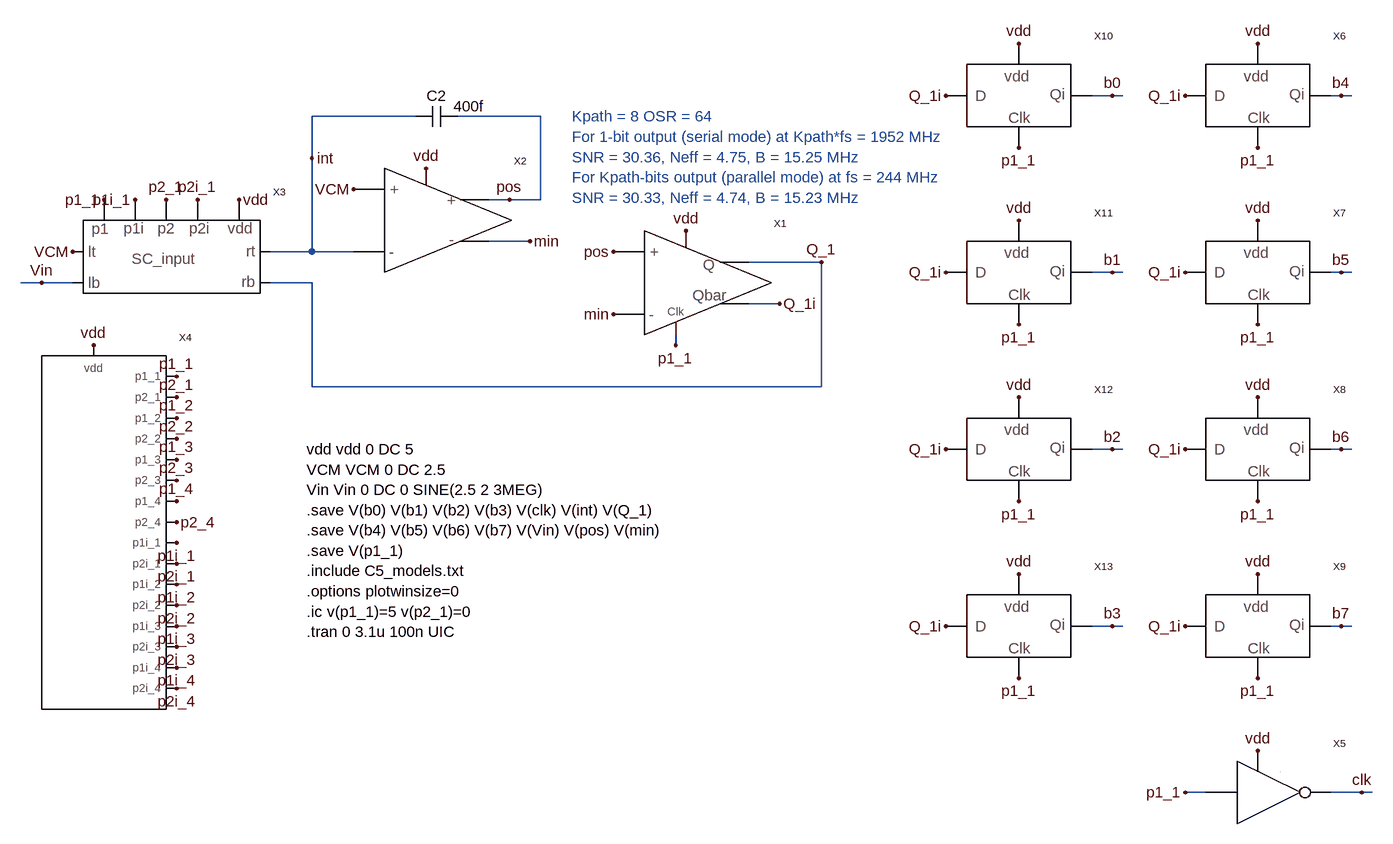
[diagram p0: schematic _Fig9_33_1bit_Matlab_MSD.asc]
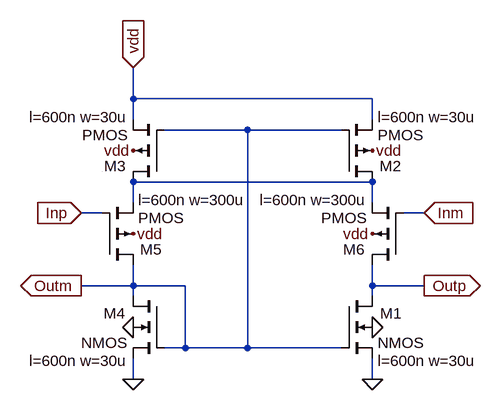
[diagram p1: sub-circuit amp.asc]
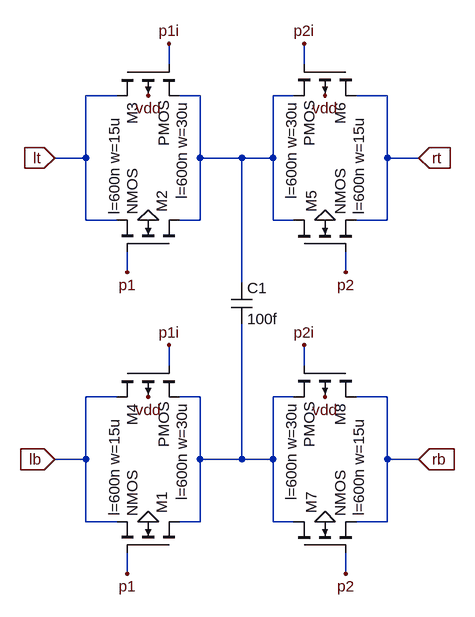
[diagram p2: sub-circuit sc_input.asc]
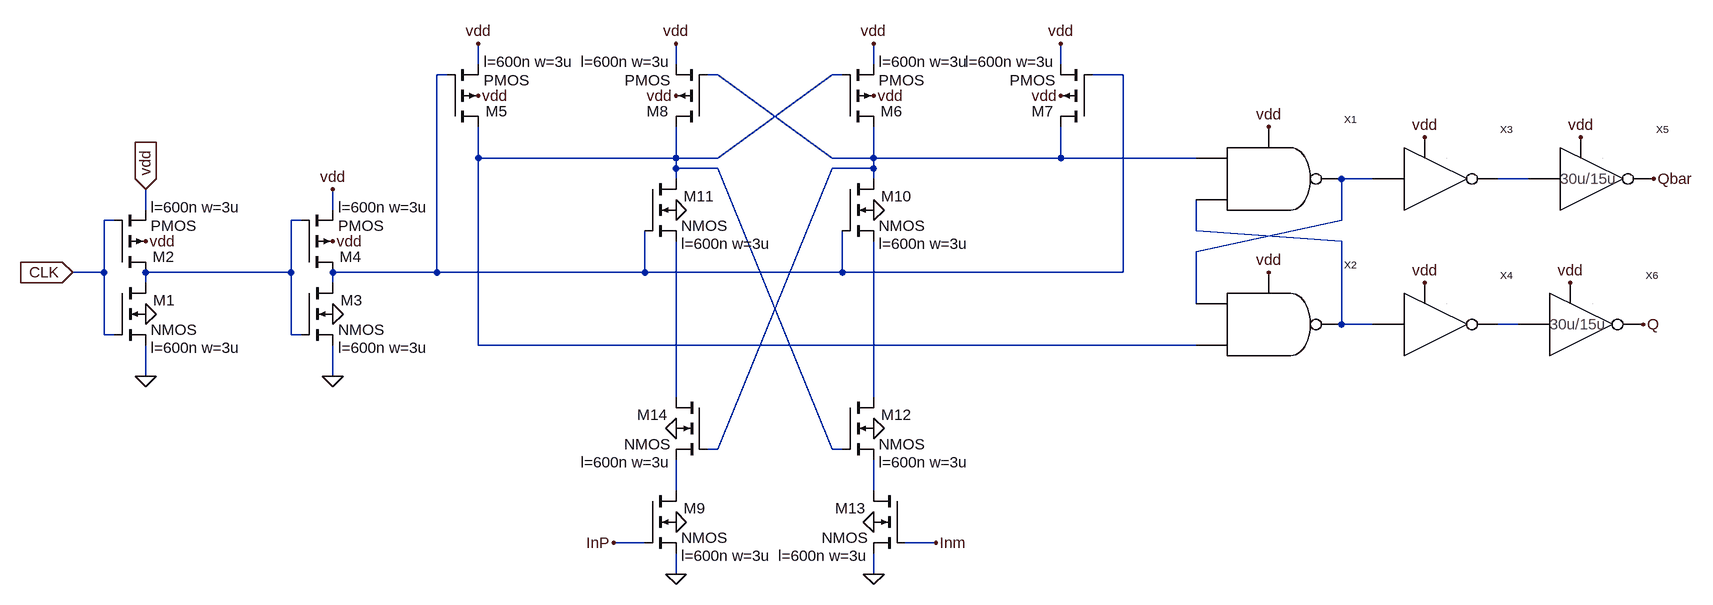
[diagram p3: sub-circuit clk_comparator.asc]
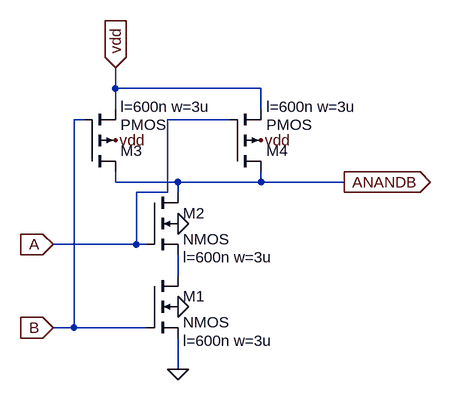
[diagram p4: sub-circuit nand_2.asc]
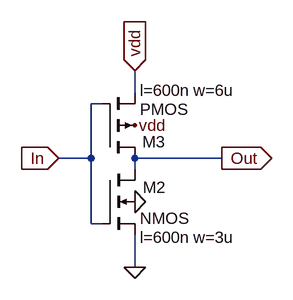
[diagram p5: sub-circuit inv_6u_3u.asc]
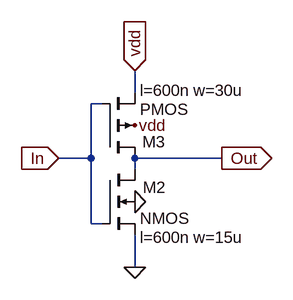
[diagram p6: sub-circuit inv_30u_15u.asc]
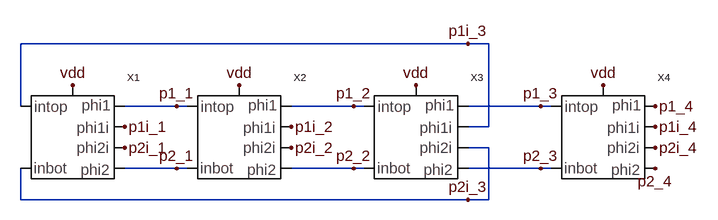
[diagram p7: sub-circuit clock_gen.asc]
_Fig9_33_1bit_Matlab_MSD.asc, the LTspice schematic file:
Version 4
SHEET 1 4120 2204
WIRE 2112 800 2080 800
WIRE 2128 800 2112 800
WIRE 2464 800 2448 800
WIRE 2480 800 2464 800
WIRE 1040 832 880 832
WIRE 1232 832 1104 832
WIRE 880 896 880 832
WIRE 1184 960 1152 960
WIRE 1232 960 1232 832
WIRE 1232 960 1184 960
WIRE 1216 1024 1152 1024
WIRE 880 1040 880 896
WIRE 880 1040 816 1040
WIRE 944 1040 880 1040
WIRE 1664 1056 1552 1056
WIRE 2112 1072 2080 1072
WIRE 2128 1072 2112 1072
WIRE 2464 1072 2448 1072
WIRE 2480 1072 2464 1072
WIRE 464 1088 432 1088
WIRE 512 1088 464 1088
WIRE 880 1088 816 1088
WIRE 1600 1120 1552 1120
WIRE 1440 1184 1440 1168
WIRE 880 1248 880 1088
WIRE 1664 1248 1664 1056
WIRE 1664 1248 880 1248
WIRE 2112 1344 2080 1344
WIRE 2128 1344 2112 1344
WIRE 2464 1344 2448 1344
WIRE 2480 1344 2464 1344
WIRE 2112 1616 2080 1616
WIRE 2128 1616 2112 1616
WIRE 2464 1616 2448 1616
WIRE 2480 1616 2464 1616
WIRE 2256 1872 2224 1872
WIRE 2496 1872 2448 1872
WIRE 2512 1872 2496 1872
FLAG 464 1088 Vin
FLAG 768 960 vdd
FLAG 560 960 p1_1
FLAG 656 960 p2_1
FLAG 512 1040 VCM
FLAG 1456 1008 vdd
FLAG 1440 1184 p1_1
FLAG 1664 1056 Q_1
FLAG 1344 1136 min
FLAG 1344 1040 pos
FLAG 944 944 VCM
FLAG 1184 960 pos
FLAG 880 896 int
FLAG 2224 1872 p1_1
FLAG 2112 800 b0
FLAG 2112 1072 b1
FLAG 2112 1344 b2
FLAG 2112 1616 b3
FLAG 2464 800 b4
FLAG 2464 1072 b5
FLAG 2464 1344 b6
FLAG 2464 1616 b7
FLAG 2336 1808 vdd
FLAG 2496 1872 clk
FLAG 1056 912 vdd
FLAG 1216 1024 min
FLAG 608 960 p1i_1
FLAG 704 960 p2i_1
FLAG 1600 1120 Q_1i
FLAG 544 1184 vdd
FLAG 672 1232 p1_1
FLAG 672 1264 p2_1
FLAG 672 1296 p1_2
FLAG 672 1328 p2_2
FLAG 672 1360 p1_3
FLAG 672 1392 p2_3
FLAG 672 1424 p1_4
FLAG 672 1456 p2_4
FLAG 672 1488 p1i_1
FLAG 672 1520 p2i_1
FLAG 672 1552 p1i_2
FLAG 672 1584 p2i_2
FLAG 672 1616 p1i_3
FLAG 672 1648 p2i_3
FLAG 672 1680 p1i_4
FLAG 672 1712 p2i_4
FLAG 2336 720 vdd
FLAG 2224 800 Q_1i
FLAG 2336 880 p1_1
FLAG 2336 992 vdd
FLAG 2224 1072 Q_1i
FLAG 2336 1152 p1_1
FLAG 2336 1264 vdd
FLAG 2224 1344 Q_1i
FLAG 2336 1424 p1_1
FLAG 2336 1536 vdd
FLAG 2224 1616 Q_1i
FLAG 2336 1696 p1_1
FLAG 1968 720 vdd
FLAG 1856 800 Q_1i
FLAG 1968 880 p1_1
FLAG 1968 992 vdd
FLAG 1856 1072 Q_1i
FLAG 1968 1152 p1_1
FLAG 1968 1264 vdd
FLAG 1856 1344 Q_1i
FLAG 1968 1424 p1_1
FLAG 1968 1536 vdd
FLAG 1856 1616 Q_1i
FLAG 1968 1696 p1_1
SYMBOL cap 1040 848 R270
WINDOW 0 32 32 VTop 2
WINDOW 3 47 82 VBottom 2
SYMATTR InstName C2
SYMATTR Value 400f
SYMBOL amp 992 992 R0
SYMATTR InstName X2
SYMBOL SC_input 576 1120 R0
SYMATTR InstName X3
SYMBOL clk_comparator 1392 1088 R0
SYMATTR InstName X1
SYMBOL clock_gen 592 1360 R0
SYMATTR InstName X4
SYMBOL Inv_6u_3u 2256 1872 R0
SYMATTR InstName X5
SYMBOL dflop 2256 848 R0
SYMATTR InstName X6
SYMBOL dflop 2256 1120 R0
SYMATTR InstName X7
SYMBOL dflop 2256 1392 R0
SYMATTR InstName X8
SYMBOL dflop 2256 1664 R0
SYMATTR InstName X9
SYMBOL dflop 1888 848 R0
SYMATTR InstName X10
SYMBOL dflop 1888 1120 R0
SYMATTR InstName X11
SYMBOL dflop 1888 1392 R0
SYMATTR InstName X12
SYMBOL dflop 1888 1664 R0
SYMATTR InstName X13
TEXT 1280 832 Left 2 ;Kpath = 8 OSR = 64\nFor 1-bit output (serial mode) at Kpath*fs = 1952 MHz\nSNR = 30.36, Neff = 4.75, B = 15.25 MHz\nFor Kpath-bits output (parallel mode) at fs = 244 MHz\nSNR = 30.33, Neff = 4.74, B = 15.23 MHz
TEXT 872 1344 Left 2 !vdd vdd 0 DC 5\nVCM VCM 0 DC 2.5\nVin Vin 0 DC 0 SINE(2.5 2 3MEG)\n.save V(b0) V(b1) V(b2) V(b3) V(clk) V(int) V(Q_1)\n.save V(b4) V(b5) V(b6) V(b7) V(Vin) V(pos) V(min)\n.save V(p1_1)\n.include C5_models.txt\n.options plotwinsize=0\n.ic v(p1_1)=5 v(p2_1)=0\n.tran 0 3.1u 100n UIC

amp.asc, the sub-circuit schematic file:
Version 4
SHEET 1 880 680
WIRE 48 -112 48 -160
WIRE 416 -112 48 -112
WIRE 48 -80 48 -112
WIRE 416 -80 416 -112
WIRE 224 -64 96 -64
WIRE 368 -64 224 -64
WIRE 416 16 48 16
WIRE 48 48 48 16
WIRE 416 48 416 16
WIRE 0 64 -32 64
WIRE 496 64 464 64
WIRE 48 176 48 144
WIRE 48 176 -32 176
WIRE 128 176 48 176
WIRE 416 176 416 144
WIRE 496 176 416 176
WIRE 48 192 48 176
WIRE 416 192 416 176
WIRE 128 272 128 176
WIRE 128 272 96 272
WIRE 224 272 224 -64
WIRE 224 272 128 272
WIRE 368 272 224 272
WIRE 48 320 48 288
WIRE 416 320 416 288
WIRE 0 0 0 0
FLAG 416 320 0
FLAG 416 240 0
FLAG -32 64 Inp
IOPIN -32 64 In
FLAG 416 -32 vdd
FLAG 496 176 Outp
IOPIN 496 176 Out
FLAG 48 -160 vdd
IOPIN 48 -160 In
FLAG 48 -32 vdd
FLAG 48 320 0
FLAG 48 240 0
FLAG 48 96 vdd
FLAG 416 96 vdd
FLAG 496 64 Inm
IOPIN 496 64 In
FLAG -32 176 Outm
IOPIN -32 176 Out
SYMBOL nmos4 368 192 R0
WINDOW 123 56 100 Left 2
WINDOW 0 60 27 Left 2
SYMATTR Value2 l=600n w=30u
SYMATTR InstName M1
SYMBOL pmos4 368 16 M180
WINDOW 123 56 100 Left 2
WINDOW 0 59 24 Left 2
SYMATTR Value2 l=600n w=30u
SYMATTR InstName M2
SYMBOL pmos4 96 16 R180
WINDOW 123 56 100 Left 2
WINDOW 0 59 24 Left 2
SYMATTR Value2 l=600n w=30u
SYMATTR InstName M3
SYMBOL nmos4 96 192 M0
WINDOW 123 56 100 Left 2
WINDOW 0 60 27 Left 2
SYMATTR Value2 l=600n w=30u
SYMATTR InstName M4
SYMBOL pmos4 0 144 M180
WINDOW 123 56 100 Left 2
WINDOW 0 59 24 Left 2
SYMATTR Value2 l=600n w=300u
SYMATTR InstName M5
SYMBOL pmos4 464 144 R180
WINDOW 123 56 100 Left 2
WINDOW 0 59 24 Left 2
SYMATTR Value2 l=600n w=300u
SYMATTR InstName M6

sc_input.asc, the sub-circuit schematic file:
Version 4
SHEET 1 880 716
WIRE 320 -144 320 -176
WIRE 528 -144 528 -176
WIRE 240 -96 192 -96
WIRE 368 -96 336 -96
WIRE 512 -96 480 -96
WIRE 656 -96 608 -96
WIRE 192 0 192 -96
WIRE 192 0 144 0
WIRE 368 0 368 -96
WIRE 432 0 368 0
WIRE 480 0 480 -96
WIRE 480 0 432 0
WIRE 656 0 656 -96
WIRE 704 0 656 0
WIRE 192 96 192 0
WIRE 240 96 192 96
WIRE 368 96 368 0
WIRE 368 96 336 96
WIRE 480 96 480 0
WIRE 512 96 480 96
WIRE 656 96 656 0
WIRE 656 96 608 96
WIRE 256 176 256 144
WIRE 592 176 592 144
WIRE 432 192 432 0
WIRE 320 320 320 288
WIRE 528 320 528 288
WIRE 240 368 192 368
WIRE 368 368 336 368
WIRE 512 368 480 368
WIRE 656 368 608 368
WIRE 192 464 192 368
WIRE 192 464 144 464
WIRE 368 464 368 368
WIRE 432 464 432 256
WIRE 432 464 368 464
WIRE 480 464 480 368
WIRE 480 464 432 464
WIRE 656 464 656 368
WIRE 704 464 656 464
WIRE 192 560 192 464
WIRE 240 560 192 560
WIRE 368 560 368 464
WIRE 368 560 336 560
WIRE 480 560 480 464
WIRE 512 560 480 560
WIRE 656 560 656 464
WIRE 656 560 608 560
WIRE 256 640 256 608
WIRE 592 640 592 608
FLAG 288 96 0
FLAG 288 -96 vdd
FLAG 144 0 lt
IOPIN 144 0 In
FLAG 320 -176 p1i
FLAG 256 176 p1
FLAG 288 560 0
FLAG 288 368 vdd
FLAG 144 464 lb
IOPIN 144 464 In
FLAG 320 288 p1i
FLAG 256 640 p1
FLAG 560 96 0
FLAG 560 -96 vdd
FLAG 704 0 rt
IOPIN 704 0 In
FLAG 528 -176 p2i
FLAG 592 176 p2
FLAG 560 560 0
FLAG 560 368 vdd
FLAG 704 464 rb
IOPIN 704 464 In
FLAG 528 288 p2i
FLAG 592 640 p2
SYMBOL nmos4 336 144 M270
WINDOW 123 56 100 Left 2
WINDOW 0 60 27 Left 2
SYMATTR Value2 l=600n w=15u
SYMATTR InstName M2
SYMBOL pmos4 240 -144 M90
WINDOW 123 56 100 Left 2
WINDOW 0 59 24 Left 2
SYMATTR Value2 l=600n w=30u
SYMATTR InstName M3
SYMBOL nmos4 336 608 M270
WINDOW 123 56 100 Left 2
WINDOW 0 60 27 Left 2
SYMATTR Value2 l=600n w=15u
SYMATTR InstName M1
SYMBOL pmos4 240 320 M90
WINDOW 123 56 100 Left 2
WINDOW 0 59 24 Left 2
SYMATTR Value2 l=600n w=30u
SYMATTR InstName M4
SYMBOL nmos4 512 144 R270
WINDOW 123 56 100 Left 2
WINDOW 0 60 27 Left 2
SYMATTR Value2 l=600n w=15u
SYMATTR InstName M5
SYMBOL pmos4 608 -144 R90
WINDOW 123 56 100 Left 2
WINDOW 0 59 24 Left 2
SYMATTR Value2 l=600n w=30u
SYMATTR InstName M6
SYMBOL nmos4 512 608 R270
WINDOW 123 56 100 Left 2
WINDOW 0 60 27 Left 2
SYMATTR Value2 l=600n w=15u
SYMATTR InstName M7
SYMBOL pmos4 608 320 R90
WINDOW 123 56 100 Left 2
WINDOW 0 59 24 Left 2
SYMATTR Value2 l=600n w=30u
SYMATTR InstName M8
SYMBOL cap 416 192 R0
SYMATTR InstName C1
SYMATTR Value 100f

clk_comparator.asc, the sub-circuit schematic file:
Version 4
SHEET 1 2480 680
WIRE 592 -416 592 -448
WIRE 896 -416 896 -448
WIRE 1200 -416 1200 -448
WIRE 1488 -416 1488 -448
WIRE 544 -400 528 -400
WIRE 960 -400 944 -400
WIRE 1152 -400 1136 -400
WIRE 1584 -400 1536 -400
WIRE 592 -272 592 -320
WIRE 896 -272 896 -320
WIRE 896 -272 592 -272
WIRE 960 -272 1136 -400
WIRE 960 -272 896 -272
WIRE 1136 -272 960 -400
WIRE 1200 -272 1200 -320
WIRE 1200 -272 1136 -272
WIRE 1488 -272 1488 -320
WIRE 1488 -272 1200 -272
WIRE 1696 -272 1488 -272
WIRE 896 -256 896 -272
WIRE 960 -256 896 -256
WIRE 1200 -256 1200 -272
WIRE 1200 -256 1136 -256
WIRE 896 -240 896 -256
WIRE 1200 -240 1200 -256
WIRE 1968 -240 1920 -240
WIRE 2208 -240 2160 -240
WIRE 80 -192 80 -224
WIRE 368 -192 368 -224
WIRE 32 -176 16 -176
WIRE 320 -176 304 -176
WIRE 1920 -176 1920 -240
WIRE 1696 -160 1696 -208
WIRE 1920 -144 1696 -160
WIRE 1696 -128 1920 -176
WIRE 16 -96 16 -176
WIRE 16 -96 -32 -96
WIRE 304 -96 304 -176
WIRE 304 -96 80 -96
WIRE 528 -96 528 -400
WIRE 528 -96 368 -96
WIRE 848 -96 848 -160
WIRE 848 -96 528 -96
WIRE 1152 -96 1152 -160
WIRE 1152 -96 848 -96
WIRE 1584 -96 1584 -400
WIRE 1584 -96 1152 -96
WIRE 80 -80 80 -96
WIRE 368 -80 368 -96
WIRE 1696 -48 1696 -128
WIRE 1920 -16 1920 -144
WIRE 1968 -16 1920 -16
WIRE 2192 -16 2160 -16
WIRE 16 0 16 -96
WIRE 32 0 16 0
WIRE 304 0 304 -96
WIRE 320 0 304 0
WIRE 592 16 592 -272
WIRE 1696 16 592 16
WIRE 80 64 80 16
WIRE 368 64 368 16
WIRE 896 96 896 -144
WIRE 1200 96 1200 -144
WIRE 960 176 1136 -256
WIRE 960 176 944 176
WIRE 1136 176 960 -256
WIRE 1152 176 1136 176
WIRE 896 240 896 192
WIRE 1200 240 1200 192
WIRE 848 320 800 320
WIRE 1296 320 1248 320
WIRE 896 368 896 336
WIRE 1200 368 1200 336
FLAG 80 64 0
FLAG 80 -32 0
FLAG -32 -96 CLK
IOPIN -32 -96 In
FLAG 80 -224 vdd
IOPIN 80 -224 In
FLAG 80 -144 vdd
FLAG 368 64 0
FLAG 368 -32 0
FLAG 368 -224 vdd
FLAG 368 -144 vdd
FLAG 592 -448 vdd
FLAG 592 -368 vdd
FLAG 1200 -448 vdd
FLAG 1200 -368 vdd
FLAG 1488 -448 vdd
FLAG 1488 -368 vdd
FLAG 896 -448 vdd
FLAG 896 -368 vdd
FLAG 896 288 0
FLAG 1200 -192 0
FLAG 896 -192 0
FLAG 1200 144 0
FLAG 896 368 0
FLAG 800 320 InP
FLAG 1200 288 0
FLAG 1200 368 0
FLAG 1296 320 Inm
FLAG 896 144 0
FLAG 1808 -320 vdd
FLAG 1808 -96 vdd
FLAG 2048 -304 vdd
FLAG 2048 -80 vdd
FLAG 2272 -80 vdd
FLAG 2288 -304 vdd
FLAG 2400 -240 Qbar
FLAG 2384 -16 Q
SYMBOL nmos4 32 -80 R0
WINDOW 123 56 100 Left 2
WINDOW 0 60 27 Left 2
SYMATTR Value2 l=600n w=3u
SYMATTR InstName M1
SYMBOL pmos4 32 -96 M180
WINDOW 123 56 100 Left 2
WINDOW 0 59 24 Left 2
SYMATTR Value2 l=600n w=3u
SYMATTR InstName M2
SYMBOL nmos4 320 -80 R0
WINDOW 123 56 100 Left 2
WINDOW 0 60 27 Left 2
SYMATTR Value2 l=600n w=3u
SYMATTR InstName M3
SYMBOL pmos4 320 -96 M180
WINDOW 123 56 100 Left 2
WINDOW 0 59 24 Left 2
SYMATTR Value2 l=600n w=3u
SYMATTR InstName M4
SYMBOL pmos4 544 -320 M180
WINDOW 123 56 100 Left 2
WINDOW 0 59 24 Left 2
SYMATTR Value2 l=600n w=3u
SYMATTR InstName M5
SYMBOL pmos4 1152 -320 M180
WINDOW 123 56 100 Left 2
WINDOW 0 59 24 Left 2
SYMATTR Value2 l=600n w=3u
SYMATTR InstName M6
SYMBOL pmos4 1536 -320 R180
WINDOW 123 56 100 Left 2
WINDOW 0 59 24 Left 2
SYMATTR Value2 l=600n w=3u
SYMATTR InstName M7
SYMBOL pmos4 944 -320 R180
WINDOW 123 56 100 Left 2
WINDOW 0 59 24 Left 2
SYMATTR Value2 l=600n w=3u
SYMATTR InstName M8
SYMBOL nmos4 848 240 R0
WINDOW 123 56 100 Left 2
WINDOW 0 60 27 Left 2
SYMATTR Value2 l=600n w=3u
SYMATTR InstName M9
SYMBOL nmos4 1152 -240 R0
WINDOW 123 56 100 Left 2
WINDOW 0 60 27 Left 2
SYMATTR Value2 l=600n w=3u
SYMATTR InstName M10
SYMBOL nmos4 848 -240 R0
WINDOW 123 56 100 Left 2
WINDOW 0 60 27 Left 2
SYMATTR Value2 l=600n w=3u
SYMATTR InstName M11
SYMBOL nmos4 1152 96 R0
WINDOW 123 56 100 Left 2
WINDOW 0 60 27 Left 2
SYMATTR Value2 l=600n w=3u
SYMATTR InstName M12
SYMBOL nmos4 1248 240 M0
WINDOW 123 56 100 Left 2
WINDOW 0 60 27 Left 2
SYMATTR Value2 l=600n w=3u
SYMATTR InstName M13
SYMBOL nmos4 944 96 M0
WINDOW 123 56 100 Left 2
WINDOW 0 60 27 Left 2
SYMATTR Value2 l=600n w=3u
SYMATTR InstName M14
SYMBOL NAND_2 1728 -240 R0
SYMATTR InstName X1
SYMBOL NAND_2 1728 -16 R0
SYMATTR InstName X2
SYMBOL Inv_6u_3u 1968 -240 R0
SYMATTR InstName X3
SYMBOL Inv_6u_3u 1968 -16 R0
SYMATTR InstName X4
SYMBOL Inv_30u_15u 2208 -240 R0
SYMATTR InstName X5
SYMBOL Inv_30u_15u 2192 -16 R0
SYMATTR InstName X6

nand_2.asc, the sub-circuit schematic file:
Version 4
SHEET 1 880 680
WIRE 176 -96 176 -128
WIRE 400 -96 176 -96
WIRE 176 -64 176 -96
WIRE 400 -64 400 -96
WIRE 128 -48 112 -48
WIRE 352 -48 256 -48
WIRE 176 48 176 32
WIRE 272 48 176 48
WIRE 400 48 400 32
WIRE 400 48 272 48
WIRE 528 48 400 48
WIRE 256 64 256 -48
WIRE 256 64 208 64
WIRE 272 64 272 48
WIRE 208 144 208 64
WIRE 208 144 80 144
WIRE 224 144 208 144
WIRE 272 192 272 160
WIRE 112 272 112 -48
WIRE 112 272 80 272
WIRE 224 272 112 272
WIRE 272 336 272 288
FLAG 272 336 0
FLAG 272 240 0
FLAG 272 112 0
FLAG 80 144 A
IOPIN 80 144 In
FLAG 80 272 B
IOPIN 80 272 In
FLAG 176 -128 vdd
IOPIN 176 -128 In
FLAG 176 -16 vdd
FLAG 400 -16 vdd
FLAG 528 48 ANANDB
IOPIN 528 48 Out
SYMBOL nmos4 224 192 R0
WINDOW 123 56 100 Left 2
SYMATTR InstName M1
SYMATTR Value2 l=600n w=3u
SYMBOL nmos4 224 64 R0
WINDOW 123 56 100 Left 2
SYMATTR InstName M2
SYMATTR Value2 l=600n w=3u
SYMBOL pmos4 128 32 M180
WINDOW 123 56 100 Left 2
SYMATTR InstName M3
SYMATTR Value2 l=600n w=3u
SYMBOL pmos4 352 32 M180
WINDOW 123 56 100 Left 2
SYMATTR InstName M4
SYMATTR Value2 l=600n w=3u

inv_6u_3u.asc, the sub-circuit schematic file:
Version 4
SHEET 1 880 680
WIRE 272 -48 272 -80
WIRE 224 -32 208 -32
WIRE 208 48 208 -32
WIRE 208 48 160 48
WIRE 400 48 272 48
WIRE 272 64 272 48
WIRE 208 144 208 48
WIRE 224 144 208 144
WIRE 272 208 272 160
FLAG 272 208 0
FLAG 272 112 0
FLAG 160 48 In
IOPIN 160 48 In
FLAG 272 -80 vdd
IOPIN 272 -80 In
FLAG 272 0 vdd
FLAG 400 48 Out
IOPIN 400 48 Out
SYMBOL nmos4 224 64 R0
WINDOW 123 56 100 Left 2
WINDOW 0 60 27 Left 2
SYMATTR Value2 l=600n w=3u
SYMATTR InstName M2
SYMBOL pmos4 224 48 M180
WINDOW 123 56 100 Left 2
WINDOW 0 59 24 Left 2
SYMATTR Value2 l=600n w=6u
SYMATTR InstName M3

inv_30u_15u.asc, the sub-circuit schematic file:
Version 4
SHEET 1 880 680
WIRE 272 -48 272 -80
WIRE 224 -32 208 -32
WIRE 208 48 208 -32
WIRE 208 48 160 48
WIRE 400 48 272 48
WIRE 272 64 272 48
WIRE 208 144 208 48
WIRE 224 144 208 144
WIRE 272 208 272 160
FLAG 272 208 0
FLAG 272 112 0
FLAG 160 48 In
IOPIN 160 48 In
FLAG 272 -80 vdd
IOPIN 272 -80 In
FLAG 272 0 vdd
FLAG 400 48 Out
IOPIN 400 48 Out
SYMBOL nmos4 224 64 R0
WINDOW 123 56 100 Left 2
WINDOW 0 60 27 Left 2
SYMATTR Value2 l=600n w=15u
SYMATTR InstName M2
SYMBOL pmos4 224 48 M180
WINDOW 123 56 100 Left 2
WINDOW 0 59 24 Left 2
SYMATTR Value2 l=600n w=30u
SYMATTR InstName M3

clock_gen.asc, the sub-circuit schematic file:
Version 4
SHEET 1 1048 680
WIRE 672 32 -16 32
WIRE 704 32 672 32
WIRE 704 160 704 32
WIRE -16 128 -16 32
WIRE 224 128 144 128
WIRE 240 128 224 128
WIRE 496 128 400 128
WIRE 512 128 496 128
WIRE 784 128 672 128
WIRE 800 128 784 128
WIRE 704 160 672 160
WIRE 704 192 672 192
WIRE 224 224 144 224
WIRE 240 224 224 224
WIRE 496 224 400 224
WIRE 512 224 496 224
WIRE 784 224 672 224
WIRE 800 224 784 224
WIRE -16 272 -16 224
WIRE 672 272 -16 272
WIRE 704 272 704 192
WIRE 704 272 672 272
FLAG 64 96 vdd
FLAG 320 96 vdd
FLAG 592 96 vdd
FLAG 880 96 vdd
FLAG 224 128 p1_1
FLAG 496 128 p1_2
FLAG 784 128 p1_3
FLAG 960 128 p1_4
FLAG 144 160 p1i_1
FLAG 400 160 p1i_2
FLAG 672 32 p1i_3
FLAG 960 160 p1i_4
FLAG 144 192 p2i_1
FLAG 400 192 p2i_2
FLAG 672 272 p2i_3
FLAG 960 192 p2i_4
FLAG 224 224 p2_1
FLAG 496 224 p2_2
FLAG 784 224 p2_3
FLAG 960 224 p2_4
SYMBOL delay 64 176 R0
SYMATTR InstName X1
SYMBOL delay 320 176 R0
SYMATTR InstName X2
SYMBOL delay 592 176 R0
SYMATTR InstName X3
SYMBOL delay 880 176 R0
SYMATTR InstName X4

delay.asc, the sub-circuit schematic file:
Version 4
SHEET 1 1340 680
WIRE 1216 -16 960 -16
WIRE 48 96 0 96
WIRE 304 128 272 128
WIRE 528 128 496 128
WIRE 752 128 720 128
WIRE 960 128 960 -16
WIRE 960 128 944 128
WIRE 976 128 960 128
WIRE 1216 128 1168 128
WIRE 48 208 48 160
WIRE 736 208 48 208
WIRE 752 240 752 128
WIRE 752 240 48 240
WIRE 48 336 48 240
WIRE 304 368 272 368
WIRE 544 368 496 368
WIRE 736 368 736 208
WIRE 768 368 736 368
WIRE 992 368 960 368
WIRE 1216 368 1184 368
WIRE 48 400 0 400
WIRE 960 512 960 368
WIRE 1216 512 960 512
FLAG 384 64 vdd
FLAG 160 48 vdd
FLAG 608 64 vdd
FLAG 624 304 vdd
FLAG 384 304 vdd
FLAG 160 288 vdd
FLAG 832 64 vdd
FLAG 1056 64 vdd
FLAG 848 304 vdd
FLAG 1072 304 vdd
FLAG 1216 -16 phi1
IOPIN 1216 -16 Out
FLAG 1216 128 phi1i
IOPIN 1216 128 Out
FLAG 1216 368 phi2i
IOPIN 1216 368 Out
FLAG 1216 512 phi2
IOPIN 1216 512 Out
FLAG 0 96 intop
IOPIN 0 96 In
FLAG 0 400 inbot
IOPIN 0 400 In
SYMBOL NAND_2 80 128 R0
SYMATTR InstName X1
SYMBOL NAND_2 80 368 R0
SYMATTR InstName X2
SYMBOL Inv_6u_3u 304 128 R0
SYMATTR InstName X3
SYMBOL Inv_6u_3u 304 368 R0
SYMATTR InstName X4
SYMBOL Inv_6u_3u 528 128 R0
SYMATTR InstName X5
SYMBOL Inv_6u_3u 544 368 R0
SYMATTR InstName X6
SYMBOL Inv_30u_15u 752 128 R0
SYMATTR InstName X7
SYMBOL Inv_30u_15u 768 368 R0
SYMATTR InstName X8
SYMBOL Inv_30u_15u 976 128 R0
SYMATTR InstName X9
SYMBOL Inv_30u_15u 992 368 R0
SYMATTR InstName X10

dflop.asc, the sub-circuit schematic file:
Version 4
SHEET 1 1692 680
WIRE 272 -208 272 -240
WIRE 560 -208 560 -240
WIRE 848 -208 848 -240
WIRE 192 -192 160 -192
WIRE 224 -192 192 -192
WIRE 512 -192 480 -192
WIRE 800 -192 768 -192
WIRE 1136 -176 1136 -208
WIRE 1392 -176 1392 -208
WIRE 1088 -160 1056 -160
WIRE 1344 -160 1312 -160
WIRE 560 -96 560 -112
WIRE 768 -96 768 -192
WIRE 768 -96 560 -96
WIRE 480 -80 480 -192
WIRE 480 -80 208 -80
WIRE 480 -64 480 -80
WIRE 704 -64 480 -64
WIRE 848 -64 848 -112
WIRE 1056 -64 1056 -160
WIRE 1056 -64 848 -64
WIRE 272 -48 272 -112
WIRE 560 -48 560 -96
WIRE 848 -48 848 -64
WIRE 1136 -48 1136 -80
WIRE 1312 -48 1312 -160
WIRE 1312 -48 1136 -48
WIRE 1392 -48 1392 -80
WIRE 1504 -48 1392 -48
WIRE 208 -32 208 -80
WIRE 208 -32 160 -32
WIRE 224 -32 208 -32
WIRE 1136 -16 1136 -48
WIRE 1392 -16 1392 -48
WIRE 512 32 400 32
WIRE 704 32 704 -64
WIRE 800 32 704 32
WIRE 400 48 400 32
WIRE 400 48 272 48
WIRE 272 64 272 48
WIRE 560 64 560 48
WIRE 848 64 848 48
WIRE 1056 64 1056 -64
WIRE 1088 64 1056 64
WIRE 1312 64 1312 -48
WIRE 1344 64 1312 64
WIRE 1136 128 1136 80
WIRE 1392 128 1392 80
WIRE 192 144 192 -192
WIRE 224 144 192 144
WIRE 480 144 480 -64
WIRE 512 144 480 144
WIRE 768 144 768 -96
WIRE 800 144 768 144
WIRE 272 208 272 160
WIRE 560 208 560 160
WIRE 848 208 848 160
FLAG 272 208 0
FLAG 272 112 0
FLAG 160 -192 D
IOPIN 160 -192 In
FLAG 272 -240 vdd
IOPIN 272 -240 In
FLAG 272 -160 vdd
FLAG 1504 -48 Qi
IOPIN 1504 -48 Out
FLAG 160 -32 Clk
IOPIN 160 -32 In
FLAG 272 0 vdd
FLAG 560 208 0
FLAG 560 112 0
FLAG 560 -240 vdd
IOPIN 560 -240 In
FLAG 560 -160 vdd
FLAG 560 0 0
FLAG 848 208 0
FLAG 848 112 0
FLAG 848 -240 vdd
IOPIN 848 -240 In
FLAG 848 -160 vdd
FLAG 848 0 0
FLAG 1136 128 0
FLAG 1136 32 0
FLAG 1136 -208 vdd
IOPIN 1136 -208 In
FLAG 1136 -128 vdd
FLAG 1392 128 0
FLAG 1392 32 0
FLAG 1392 -208 vdd
IOPIN 1392 -208 In
FLAG 1392 -128 vdd
SYMBOL nmos4 224 64 R0
WINDOW 123 56 100 Left 2
WINDOW 0 60 27 Left 2
SYMATTR Value2 l=600n w=3u
SYMATTR InstName M2
SYMBOL pmos4 224 -112 M180
WINDOW 123 56 100 Left 2
WINDOW 0 59 24 Left 2
SYMATTR Value2 l=600n w=3u
SYMATTR InstName M3
SYMBOL pmos4 224 48 M180
WINDOW 123 56 100 Left 2
WINDOW 0 59 24 Left 2
SYMATTR Value2 l=600n w=3u
SYMATTR InstName M1
SYMBOL nmos4 512 64 R0
WINDOW 123 56 100 Left 2
WINDOW 0 60 27 Left 2
SYMATTR Value2 l=600n w=3u
SYMATTR InstName M4
SYMBOL pmos4 512 -112 M180
WINDOW 123 56 100 Left 2
WINDOW 0 59 24 Left 2
SYMATTR Value2 l=600n w=3u
SYMATTR InstName M5
SYMBOL nmos4 512 -48 R0
WINDOW 123 56 100 Left 2
WINDOW 0 60 27 Left 2
SYMATTR Value2 l=600n w=3u
SYMATTR InstName M6
SYMBOL nmos4 800 64 R0
WINDOW 123 56 100 Left 2
WINDOW 0 60 27 Left 2
SYMATTR Value2 l=600n w=3u
SYMATTR InstName M7
SYMBOL pmos4 800 -112 M180
WINDOW 123 56 100 Left 2
WINDOW 0 59 24 Left 2
SYMATTR Value2 l=600n w=3u
SYMATTR InstName M8
SYMBOL nmos4 800 -48 R0
WINDOW 123 56 100 Left 2
WINDOW 0 60 27 Left 2
SYMATTR Value2 l=600n w=3u
SYMATTR InstName M9
SYMBOL nmos4 1088 -16 R0
WINDOW 123 56 100 Left 2
WINDOW 0 60 27 Left 2
SYMATTR Value2 l=600n w=3u
SYMATTR InstName M10
SYMBOL pmos4 1088 -80 M180
WINDOW 123 56 100 Left 2
WINDOW 0 59 24 Left 2
SYMATTR Value2 l=600n w=3u
SYMATTR InstName M11
SYMBOL nmos4 1344 -16 R0
WINDOW 123 56 100 Left 2
WINDOW 0 60 27 Left 2
SYMATTR Value2 l=600n w=3u
SYMATTR InstName M12
SYMBOL pmos4 1344 -80 M180
WINDOW 123 56 100 Left 2
WINDOW 0 59 24 Left 2
SYMATTR Value2 l=600n w=3u
SYMATTR InstName M13

The netlist it stands for:
* _Fig9_33_1bit_Matlab_MSD.asc
C2 int pos 400f
XX2 VCM int pos min vdd amp
XX3 vdd p1_1 p2_1 VCM Vin int Q_1 p1i_1 p2i_1 sc_input
XX1 pos min Q_1 Q_1i vdd p1_1 clk_comparator
XX4 p1_1 p2_1 p1_2 p2_2 p1_3 p2_3 p1_4 p2_4 p1i_1 p2i_1 p1i_2 p2i_2 p1i_3 p2i_3 p1i_4 p2i_4 vdd clock_gen
XX5 p1_1 clk vdd inv_6u_3u
XX6 Q_1i p1_1 b4 vdd dflop
XX7 Q_1i p1_1 b5 vdd dflop
XX8 Q_1i p1_1 b6 vdd dflop
XX9 Q_1i p1_1 b7 vdd dflop
XX10 Q_1i p1_1 b0 vdd dflop
XX11 Q_1i p1_1 b1 vdd dflop
XX12 Q_1i p1_1 b2 vdd dflop
XX13 Q_1i p1_1 b3 vdd dflop

* block symbol definitions
.subckt amp Inp Inm Outp Outm vdd
M1 Outp Outm 0 0 NMOS l=600n w=30u
M2 N001 Outm vdd vdd PMOS l=600n w=30u
M3 N001 Outm vdd vdd PMOS l=600n w=30u
M4 Outm Outm 0 0 NMOS l=600n w=30u
M5 Outm Inp N001 vdd PMOS l=600n w=300u
M6 Outp Inm N001 vdd PMOS l=600n w=300u
.ends amp

.subckt sc_input VDD p1 p2 lt lb rt rb p1i p2i
M2 N001 p1 lt 0 NMOS l=600n w=15u
M3 lt p1i N001 vdd PMOS l=600n w=30u
M1 N002 p1 lb 0 NMOS l=600n w=15u
M4 lb p1i N002 vdd PMOS l=600n w=30u
M5 N001 p2 rt 0 NMOS l=600n w=15u
M6 rt p2i N001 vdd PMOS l=600n w=30u
M7 N002 p2 rb 0 NMOS l=600n w=15u
M8 rb p2i N002 vdd PMOS l=600n w=30u
C1 N001 N002 100f
.ends sc_input

.subckt clk_comparator InP InM Q Qbar vdd Clk
M1 N006 CLK 0 0 NMOS l=600n w=3u
M2 N006 CLK vdd vdd PMOS l=600n w=3u
M3 N001 N006 0 0 NMOS l=600n w=3u
M4 N001 N006 vdd vdd PMOS l=600n w=3u
M5 N003 N001 vdd vdd PMOS l=600n w=3u
M6 N002 N003 vdd vdd PMOS l=600n w=3u
M7 N002 N001 vdd vdd PMOS l=600n w=3u
M8 N003 N002 vdd vdd PMOS l=600n w=3u
M9 N011 InP 0 0 NMOS l=600n w=3u
M10 N002 N001 N010 0 NMOS l=600n w=3u
M11 N003 N001 N009 0 NMOS l=600n w=3u
M12 N010 N003 N012 0 NMOS l=600n w=3u
M13 N012 Inm 0 0 NMOS l=600n w=3u
M14 N009 N002 N011 0 NMOS l=600n w=3u
XX1 N002 N007 N004 vdd nand_2
XX2 N004 N003 N007 vdd nand_2
XX3 N004 N005 vdd inv_6u_3u
XX4 N007 N008 vdd inv_6u_3u
XX5 N005 Qbar vdd inv_30u_15u
XX6 N008 Q vdd inv_30u_15u
.ends clk_comparator

.subckt nand_2 A B ANANDB vdd
M1 N001 B 0 0 NMOS l=600n w=3u
M2 ANANDB A N001 0 NMOS l=600n w=3u
M3 ANANDB B vdd vdd PMOS l=600n w=3u
M4 ANANDB A vdd vdd PMOS l=600n w=3u
.ends nand_2

.subckt inv_6u_3u In Out vdd
M2 Out In 0 0 NMOS l=600n w=3u
M3 Out In vdd vdd PMOS l=600n w=6u
.ends inv_6u_3u

.subckt inv_30u_15u In Out vdd
M2 Out In 0 0 NMOS l=600n w=15u
M3 Out In vdd vdd PMOS l=600n w=30u
.ends inv_30u_15u

.subckt clock_gen p1_1 p2_1 p1_2 p2_2 p1_3 p2_3 p1_4 p2_4 p1i_1 p2i_1 p1i_2 p2i_2 p1i_3 p2i_3 p1i_4 p2i_4 vdd
XX1 p1i_3 p2i_3 p1_1 p1i_1 p2i_1 p2_1 vdd delay
XX2 p1_1 p2_1 p1_2 p1i_2 p2i_2 p2_2 vdd delay
XX3 p1_2 p2_2 p1_3 p1i_3 p2i_3 p2_3 vdd delay
XX4 p1_3 p2_3 p1_4 p1i_4 p2i_4 p2_4 vdd delay
.ends clock_gen

.subckt delay intop inbot phi1 phi1i phi2i phi2 vdd
XX1 intop N004 N001 vdd nand_2
XX2 N003 inbot N005 vdd nand_2
XX3 N001 N002 vdd inv_6u_3u
XX4 N005 N006 vdd inv_6u_3u
XX5 N002 N003 vdd inv_6u_3u
XX6 N006 N004 vdd inv_6u_3u
XX7 N003 phi1 vdd inv_30u_15u
XX8 N004 phi2 vdd inv_30u_15u
XX9 phi1 phi1i vdd inv_30u_15u
XX10 phi2 phi2i vdd inv_30u_15u
.ends delay

.subckt dflop D Clk Qi VDD
M2 N005 D 0 0 NMOS l=600n w=3u
M3 N004 D vdd vdd PMOS l=600n w=3u
M1 N005 Clk N004 vdd PMOS l=600n w=3u
M4 N006 Clk 0 0 NMOS l=600n w=3u
M5 N001 Clk vdd vdd PMOS l=600n w=3u
M6 N001 N005 N006 0 NMOS l=600n w=3u
M7 N007 N001 0 0 NMOS l=600n w=3u
M8 N002 N001 vdd vdd PMOS l=600n w=3u
M9 N002 Clk N007 0 NMOS l=600n w=3u
M10 N003 N002 0 0 NMOS l=600n w=3u
M11 N003 N002 vdd vdd PMOS l=600n w=3u
M12 Qi N003 0 0 NMOS l=600n w=3u
M13 Qi N003 vdd vdd PMOS l=600n w=3u
.ends dflop

.model NMOS NMOS
.model PMOS PMOS
.lib standard.mos
* Kpath = 8 OSR = 64
* For 1-bit output (serial mode) at Kpath*fs = 1952 MHz
* SNR = 30.36, Neff = 4.75, B = 15.25 MHz
* For Kpath-bits output (parallel mode) at fs = 244 MHz
* SNR = 30.33, Neff = 4.74, B = 15.23 MHz
vdd vdd 0 DC 5
VCM VCM 0 DC 2.5
Vin Vin 0 DC 0 SINE(2.5 2 3MEG)
.save V(b0) V(b1) V(b2) V(b3) V(clk) V(int) V(Q_1)
.save V(b4) V(b5) V(b6) V(b7) V(Vin) V(pos) V(min)
.save V(p1_1)
.include C5_models.txt
.options plotwinsize=0
.ic v(p1_1)=5 v(p2_1)=0
.tran 0 3.1u 100n UIC
.backanno
.end